# Altium project OrangePi_dev.PrjPcb
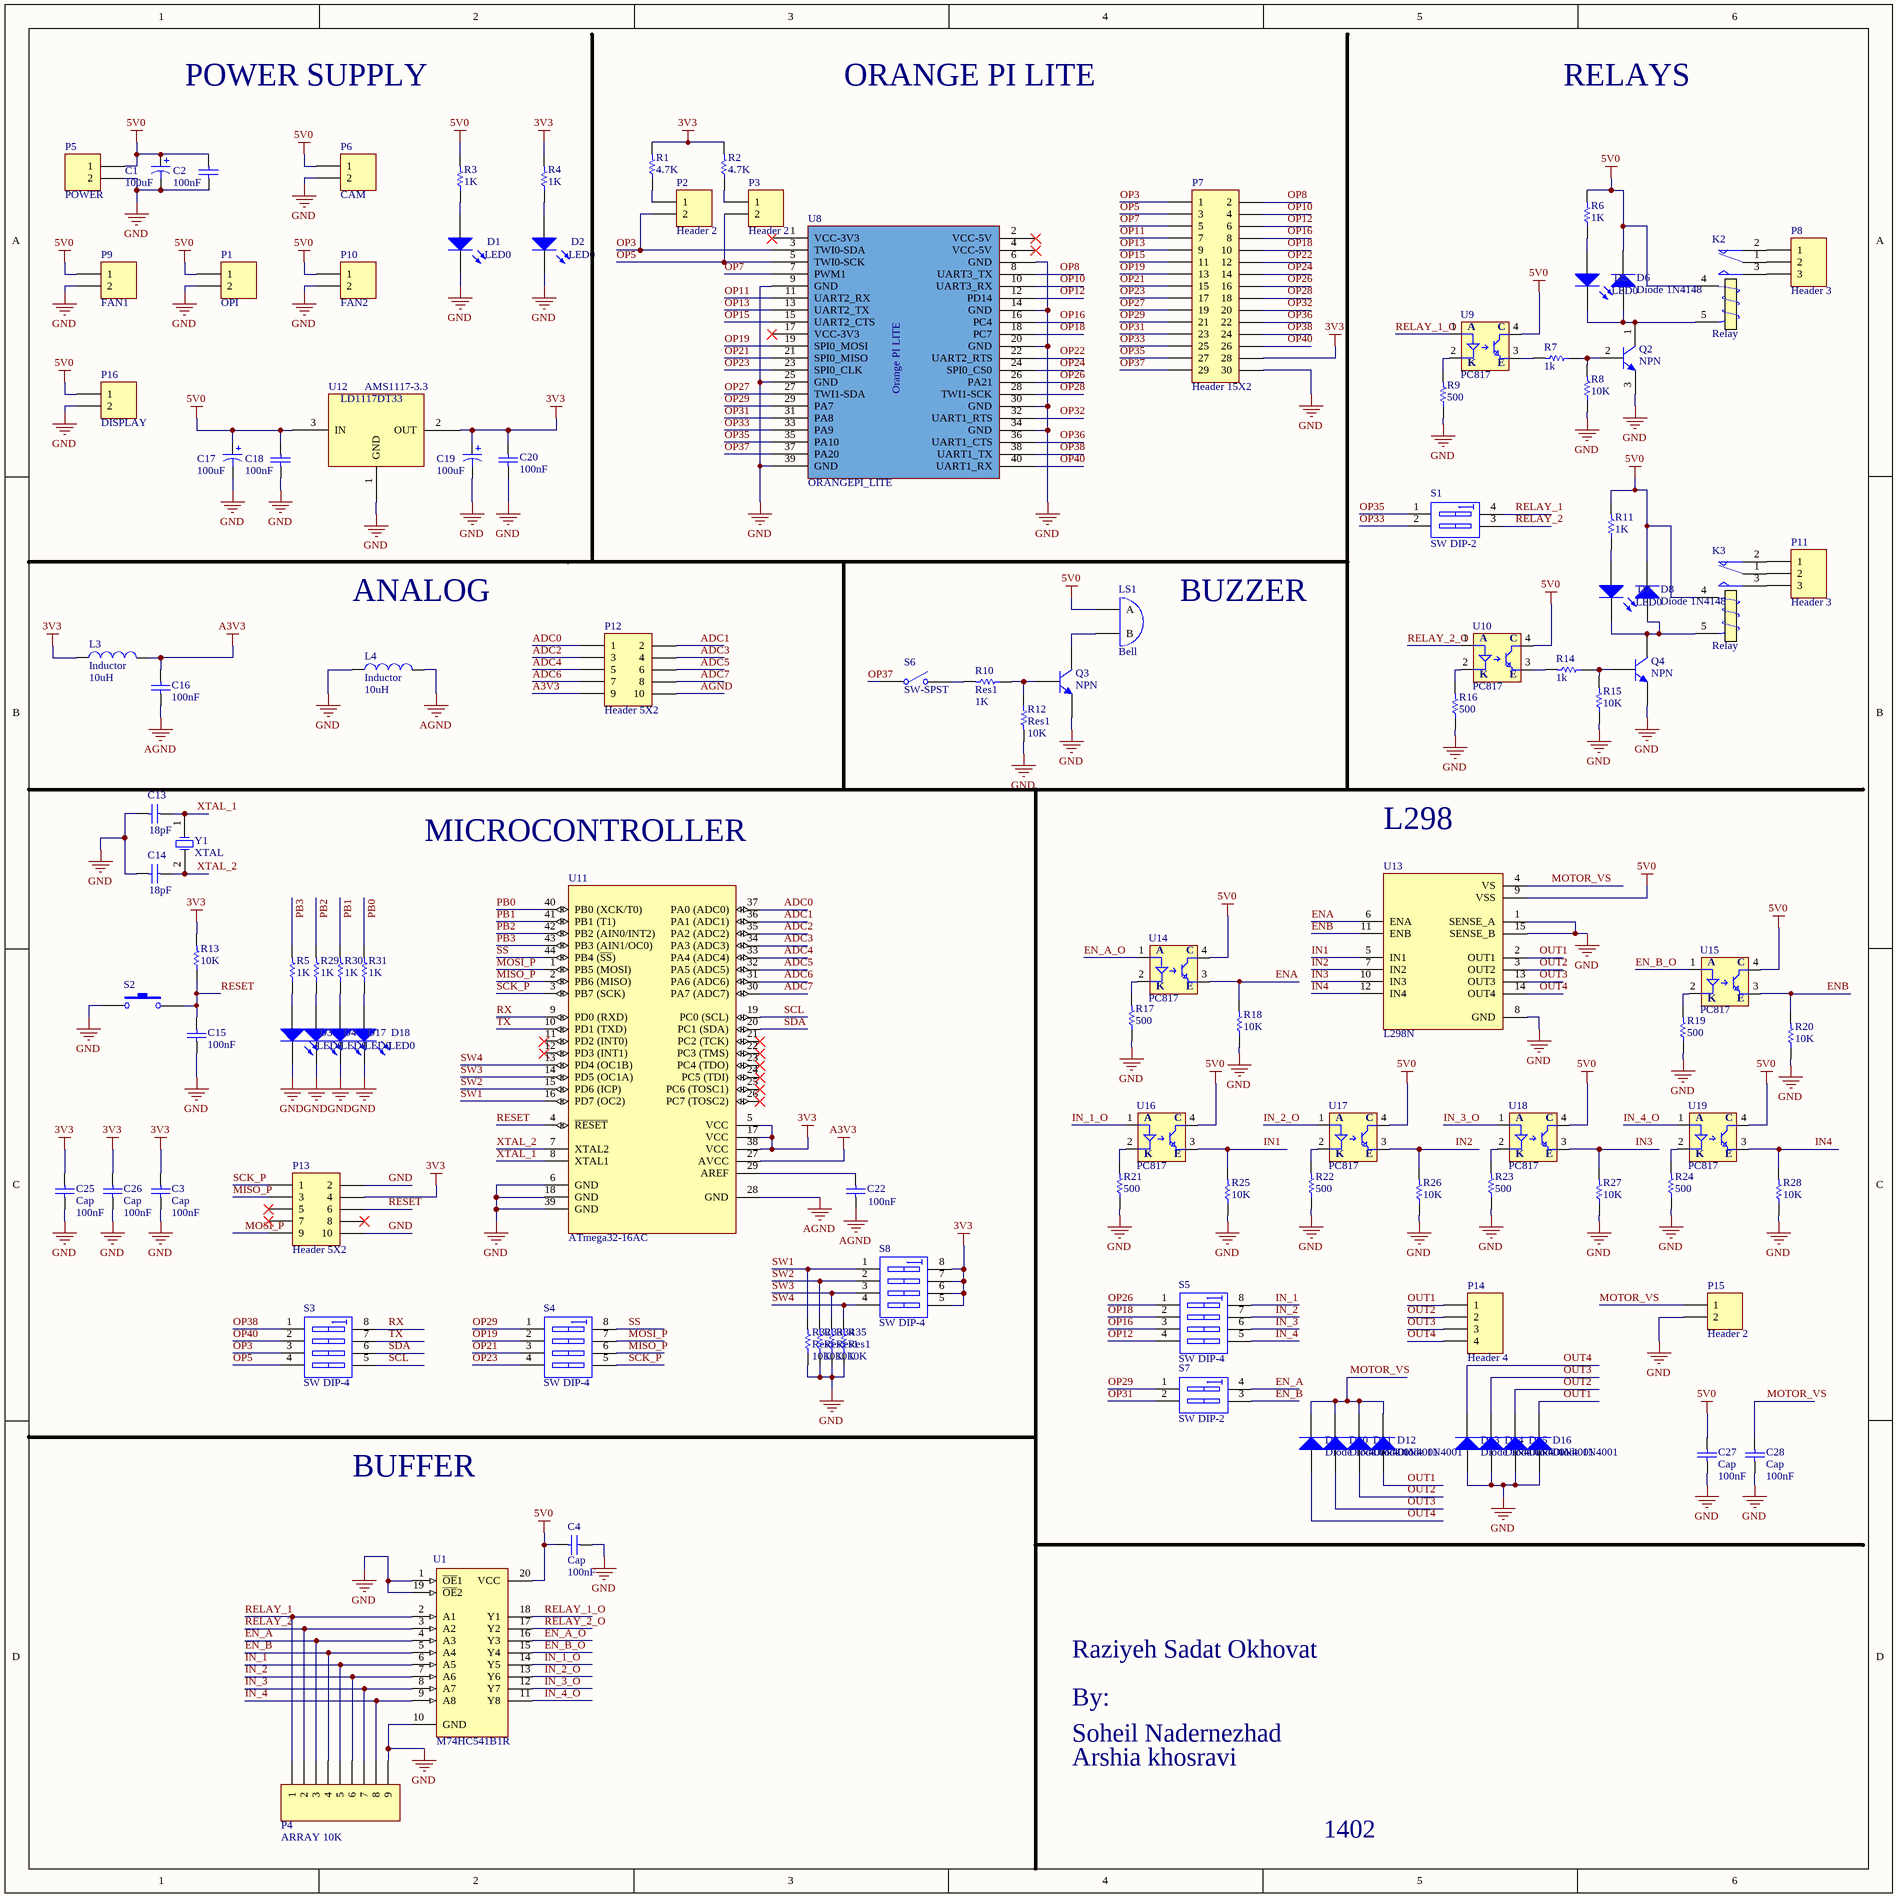
[diagram p0: OrangePi_dev4.SchDoc]
1 sheet, 116 parts. Net scope: global (net labels, ports and power ports of the same name join across sheets).
Board files: OrangePi_dev.PcbDoc, OrangePi_dev_backup.PcbDoc, OrangePi_dev3.PcbDoc

## Sheet OrangePi_dev4.SchDoc
size 400 x 400 mm; SheetNumber: 1; SheetTotal: 1

### Parts
C1  100uF  [CAP_AL]
C2  100nF  [CAP_1206]
C3  Cap  value 100nF  [CAP_1206]
C4  Cap  value 100nF  [CAP_1206]
C13  18pF  [CAP_1206]
C14  18pF  [CAP_1206]
C15  100nF  [CAP_1206]
C16  100nF  [CAP_1206]
C17  100uF  [CAP_AL]
C18  100nF  [CAP_1206]
C19  100uF  [CAP_AL]
C20  100nF  [CAP_1206]
C22  value 100nF  [CAP_1206]  (hidden comment: Cap)
C25  Cap  value 100nF  [CAP_1206]
C26  Cap  value 100nF  [CAP_1206]
C27  Cap  value 100nF  [CAP_1206]
C28  Cap  value 100nF  [CAP_1206]
D1  LED0  [LED_1206]
D2  LED0  [LED_1206]
D3  LED0  [LED_1206]
D4  LED0  [LED_1206]
D5  LED0  [LED_1206]
D6  Diode 1N4148  [1N4148]
D7  LED0  [LED_1206]
D8  Diode 1N4148  [1N4148]
D9  Diode 1N4001  [1N4007]
D10  Diode 1N4001  [1N4007]
D11  Diode 1N4001  [1N4007]
D12  Diode 1N4001  [1N4007]
D13  Diode 1N4001  [1N4007]
D14  Diode 1N4001  [1N4007]
D15  Diode 1N4001  [1N4007]
D16  Diode 1N4001  [1N4007]
D17  LED0  [LED_1206]
D18  LED0  [LED_1206]
K2  Relay  [Relay bache milon]
K3  Relay  [Relay bache milon]
L3  Inductor  value 10uH  [INDUCTOR_1206]
L4  Inductor  value 10uH  [INDUCTOR_1206]
LS1  Bell  [BUZZER]
P1  OPI  [HDR1X2]
P2  Header 2  [HDR1X2]
P3  Header 2  [HDR1X2]
P4  ARRAY 10K  [RES_ARRAY]
P5  POWER  [TERMINAL2]
P6  CAM  [HDR1X2]
P7  Header 15X2  [HEADER2X15_RA]
P8  Header 3  [PHOENIX3]
P9  FAN1  [HDR1X2]
P10  FAN2  [HDR1X2]
P11  Header 3  [PHOENIX3]
P12  Header 5X2  [HEADER2x5_RA]
P13  Header 5X2  [BOX2x5]
P14  Header 4  [PHOENIX4]
P15  Header 2  [PHOENIX2]
P16  DISPLAY  [HDR1X2]
Q2  NPN  [C945]
Q3  NPN  [C945]
Q4  NPN  [C945]
R1  4.7k  [RES_1206]
R2  4.7k  [RES_1206]
R3  value 1K  [RES_1206]  (hidden comment: Res1)
R4  value 1K  [RES_1206]  (hidden comment: Res1)
R5  value 1K  [RES_1206]  (hidden comment: Res1)
R6  value 1K  [RES_1206]  (hidden comment: Res1)
R7  value 1k  [RES_1206]  (hidden comment: Res1)
R8  value 10K  [RES_1206]  (hidden comment: Res1)
R9  value 500  [RES_1206]  (hidden comment: Res1)
R10  Res1  value 1K  [RES_1206]
R11  value 1K  [RES_1206]  (hidden comment: Res1)
R12  Res1  value 10K  [RES_1206]
R13  10K  [RES_1206]
R14  value 1k  [RES_1206]  (hidden comment: Res1)
R15  value 10K  [RES_1206]  (hidden comment: Res1)
R16  value 500  [RES_1206]  (hidden comment: Res1)
R17  value 500  [RES_1206]  (hidden comment: Res1)
R18  value 10K  [RES_1206]  (hidden comment: Res1)
R19  value 500  [RES_1206]  (hidden comment: Res1)
R20  value 10K  [RES_1206]  (hidden comment: Res1)
R21  value 500  [RES_1206]  (hidden comment: Res1)
R22  value 500  [RES_1206]  (hidden comment: Res1)
R23  value 500  [RES_1206]  (hidden comment: Res1)
R24  value 500  [RES_1206]  (hidden comment: Res1)
R25  value 10K  [RES_1206]  (hidden comment: Res1)
R26  value 10K  [RES_1206]  (hidden comment: Res1)
R27  value 10K  [RES_1206]  (hidden comment: Res1)
R28  value 10K  [RES_1206]  (hidden comment: Res1)
R29  value 1K  [RES_1206]  (hidden comment: Res1)
R30  value 1K  [RES_1206]  (hidden comment: Res1)
R31  value 1K  [RES_1206]  (hidden comment: Res1)
R32  Res1  value 10K  [RES_1206]
R33  Res1  value 10K  [RES_1206]
R34  Res1  value 10K  [RES_1206]
R35  Res1  value 10K  [RES_1206]
S1  SW DIP-2  [SW_2]
S2  PB  [BUTTON]  (value not drawn)
S3  SW DIP-4  [SW_4]
S4  SW DIP-4  [SW_4]
S5  SW DIP-4  [SW_4]
S6  SW-SPST  [HDR1X2]
S7  SW DIP-2  [SW_2]
S8  SW DIP-4  [SW_4]
U1  M74HC541B1R  [74HC541]
U8  ORANGEPI_LITE  [OPI LITE]
U9  PC817  [PC817]
U10  PC817  [PC817]
U11  ATmega32-16AC  [Atmega32]
U12  AMS1117-3.3  [AMS1117]
U13  L298N  [L298N]
U14  PC817  [PC817]
U15  PC817  [PC817]
U16  PC817  [PC817]
U17  PC817  [PC817]
U18  PC817  [PC817]
U19  PC817  [PC817]
Y1  XTAL  [CRYSTAL]

### Nets
3V3: C3.1 C19.1 C20.2 C25.1 C26.1 L3.1 P7.28 P13.4 R1.2 R2.2 R4.2 R13.2 S8.5(B4) S8.6(B3) S8.7(B2) S8.8(B1) U11.5(VCC) U11.17(VCC) U11.38(VCC) U12.2(OUT)
5V0: C1.1 C2.2 C4.1 C17.1 C18.2 C27.1 D6.2(K) D8.2(K) K2.4(T1) K3.4(T1) LS1.1(A) P1.1 P5.1 P6.1 P9.1 P10.1 P16.1 R3.2 R6.2 R11.2 U1.20(VCC) U9.4(C) U10.4(C) U12.3(IN) U13.9(VSS) U14.4(C) U15.4(C) U16.4(C) U17.4(C) U18.4(C) U19.4(C)
A3V3: C16.2 L3.2 P12.9 U11.27(AVCC)
AGND: C16.1 C22.1 L4.2 P12.10 U11.28(GND)
GND: C1.2 C2.1 C3.2 C4.2 C13.1 C14.1 C15.1 C17.2 C18.1 C19.2 C20.1 C25.2 C26.2 C27.2 C28.2 D1.2(K) D2.2(K) D3.2(K) D4.2(K) D13.1(A) D14.1(A) D15.1(A) D16.1(A) D17.2(K) D18.2(K) L4.1 P1.2 P4.9 P5.2 P6.2 P7.30 P9.2 P10.2 P13.2 P13.10 P15.2 P16.2 Q2.3(E) Q3.3(E) Q4.3(E) R8.1 R9.1 R12.2 R15.1 R16.1 R17.1 R18.1 R19.1 R20.1 R21.1 R22.1 R23.1 R24.1 R25.1 R26.1 R27.1 R28.1 R32.1 R33.1 R34.1 R35.1 S2.1 U1.1(~{OE}1) U1.10(GND) U1.19(~{OE}2) U8.6(GND) U8.9(GND) U8.14(GND) U8.20(GND) U8.25(GND) U8.30(GND) U8.34(GND) U8.39(GND) U11.6(GND) U11.18(GND) U11.39(GND) U12.1(GND) U13.1(SENSE_A) U13.8(GND) U13.15(SENSE_B)
ADC0: P12.1 U11.37(PA0_(ADC0))
ADC1: P12.2 U11.36(PA1_(ADC1))
ADC2: P12.3 U11.35(PA2_(ADC2))
ADC3: P12.4 U11.34(PA3_(ADC3))
ADC4: P12.5 U11.33(PA4_(ADC4))
ADC5: P12.6 U11.32(PA5_(ADC5))
ADC6: P12.7 U11.31(PA6_(ADC6))
ADC7: P12.8 U11.30(PA7_(ADC7))
EN_A: P4.3 S7.4(B1) U1.4(A3)
EN_A_O: U1.16(Y3) U14.1(A)
EN_B: P4.4 S7.3(B2) U1.5(A4)
EN_B_O: U1.15(Y4) U15.1(A)
ENA: R18.2 U13.6(ENA) U14.3(E)
ENB: R20.2 U13.11(ENB) U15.3(E)
IN1: R25.2 U13.5(IN1) U16.3(E)
IN2: R26.2 U13.7(IN2) U17.3(E)
IN3: R27.2 U13.10(IN3) U18.3(E)
IN4: R28.2 U13.12(IN4) U19.3(E)
IN_1: P4.5 S5.8(B1) U1.6(A5)
IN_1_O: U1.14(Y5) U16.1(A)
IN_2: P4.6 S5.7(B2) U1.7(A6)
IN_2_O: U1.13(Y6) U17.1(A)
IN_3: P4.7 S5.6(B3) U1.8(A7)
IN_3_O: U1.12(Y7) U18.1(A)
IN_4: P4.8 S5.5(B4) U1.9(A8)
IN_4_O: U1.11(Y8) U19.1(A)
MISO_P: P13.3 S4.6(B3) U11.2(PB6_(MISO))
MOSI_P: P13.9 S4.7(B2) U11.1(PB5_(MOSI))
MOTOR_VS: C28.1 D9.2(K) D10.2(K) D11.2(K) D12.2(K) P15.1 U13.4(VS)
OP3: P2.2 P7.1 S3.3(A3) U8.3(TWI0-SDA)
OP5: P3.2 P7.3 S3.4(A4) U8.5(TWI0-SCK)
OP7: P7.5 U8.7(PWM1)
OP8: P7.2 U8.8(UART3_TX)
OP10: P7.4 U8.10(UART3_RX)
OP11: P7.7 U8.11(UART2_RX)
OP12: P7.6 S5.4(A4) U8.12(PD14)
OP13: P7.9 U8.13(UART2_TX)
OP15: P7.11 U8.15(UART2_CTS)
OP16: P7.8 S5.3(A3) U8.16(PC4)
OP18: P7.10 S5.2(A2) U8.18(PC7)
OP19: P7.13 S4.2(A2) U8.19(SPI0_MOSI)
OP21: P7.15 S4.3(A3) U8.21(SPI0_MISO)
OP22: P7.12 U8.22(UART2_RTS)
OP23: P7.17 S4.4(A4) U8.23(SPI0_CLK)
OP24: P7.14 U8.24(SPI0_CS0)
OP26: P7.16 S5.1(A1) U8.26(PA21)
OP27: P7.19 U8.27(TWI1-SDA)
OP28: P7.18 U8.28(TWI1-SCK)
OP29: P7.21 S4.1(A1) S7.1(A1) U8.29(PA7)
OP31: P7.23 S7.2(A2) U8.31(PA8)
OP32: P7.20 U8.32(UART1_RTS)
OP33: P7.25 S1.2(A2) U8.33(PA9)
OP35: P7.27 S1.1(A1) U8.35(PA10)
OP36: P7.22 U8.36(UART1_CTS)
OP37: P7.29 S6.1(COMMON) U8.37(PA20)
OP38: P7.24 S3.1(A1) U8.38(UART1_TX)
OP40: P7.26 S3.2(A2) U8.40(UART1_RX)
OUT1: D12.1(A) D16.2(K) P14.1 U13.2(OUT1)
OUT2: D11.1(A) D15.2(K) P14.2 U13.3(OUT2)
OUT3: D10.1(A) D14.2(K) P14.3 U13.13(OUT3)
OUT4: D9.1(A) D13.2(K) P14.4 U13.14(OUT4)
PB0: R31.2 U11.40(PB0_(XCK/T0))
PB1: R30.2 U11.41(PB1_(T1))
PB2: R29.2 U11.42(PB2_(AIN0/INT2))
PB3: R5.2 U11.43(PB3_(AIN1/OC0))
RELAY_1: P4.1 S1.4(B1) U1.2(A1)
RELAY_1_O: U1.18(Y1) U9.1(A)
RELAY_2: P4.2 S1.3(B2) U1.3(A2)
RELAY_2_O: U1.17(Y2) U10.1(A)
RESET: C15.2 P13.6 R13.1 S2.2 U11.4(~{RESET})
RX: S3.8(B1) U11.9(PD0_(RXD))
SCK_P: P13.1 S4.5(B4) U11.3(PB7_(SCK))
SCL: S3.5(B4) U11.19(PC0_(SCL))
SDA: S3.6(B3) U11.20(PC1_(SDA))
SS: S4.8(B1) U11.44(PB4_(~{SS}))
SW1: R32.2 S8.1(A1) U11.16(PD7_(OC2))
SW2: R33.2 S8.2(A2) U11.15(PD6_(ICP))
SW3: R34.2 S8.3(A3) U11.14(PD5_(OC1A))
SW4: R35.2 S8.4(A4) U11.13(PD4_(OC1B))
TX: S3.7(B2) U11.10(PD1_(TXD))
XTAL_1: C13.2 U11.8(XTAL1) Y1.1(OSC1)
XTAL_2: C14.2 U11.7(XTAL2) Y1.2(OSC2)
NetC22_2: C22.2 U11.29(AREF)
NetD1_1: D1.1(A) R3.1
NetD2_1: D2.1(A) R4.1
NetD3_1: D3.1(A) R5.1
NetD4_1: D4.1(A) R29.1
NetD5_1: D5.1(A) R6.1
NetD5_2: D5.2(K) D6.1(A) K2.5(T2) Q2.1(C)
NetD7_1: D7.1(A) R11.1
NetD7_2: D7.2(K) D8.1(A) K3.5(T2) Q4.1(C)
NetD17_1: D17.1(A) R30.1
NetD18_1: D18.1(A) R31.1
NetK2_1: K2.1(COM) P8.2
NetK2_2: K2.2(NC) P8.1
NetK2_3: K2.3(NO) P8.3
NetK3_1: K3.1(COM) P11.2
NetK3_2: K3.2(NC) P11.1
NetK3_3: K3.3(NO) P11.3
NetLS1_2: LS1.2(B) Q3.1(C)
NetP2_1: P2.1 R1.1
NetP3_1: P3.1 R2.1
NetQ2_2: Q2.2(B) R7.1 R8.2
NetQ3_2: Q3.2(B) R10.1 R12.1
NetQ4_2: Q4.2(B) R14.1 R15.2
NetR7_2: R7.2 U9.3(E)
NetR9_2: R9.2 U9.2(K)
NetR10_2: R10.2 S6.2(NO)
NetR14_2: R14.2 U10.3(E)
NetR16_2: R16.2 U10.2(K)
NetR17_2: R17.2 U14.2(K)
NetR19_2: R19.2 U15.2(K)
NetR21_2: R21.2 U16.2(K)
NetR22_2: R22.2 U17.2(K)
NetR23_2: R23.2 U18.2(K)
NetR24_2: R24.2 U19.2(K)

Not connected (* = marked no-connect by the designer): P13 5* 7* 8*; U8 1(VCC-3V3)* 2(VCC-5V)* 4(VCC-5V)* 17(VCC-3V3)*; U11 11(PD2_(INT0))* 12(PD3_(INT1))* 21(PC2_(TCK))* 22(PC3_(TMS))* 23(PC4_(TDO))* 24(PC5_(TDI))* 25(PC6_(TOSC1))* 26(PC7_(TOSC2))*

### Notes on the sheet
- POWER SUPPLY
- ORANGE PI LITE
- RELAYS
- ANALOG
- BUZZER
- L298
- MICROCONTROLLER
- BUFFER
- Raziyeh Sadat Okhovat
- By:
- Soheil Nadernezhad
- Arshia khosravi
- 1402
- (in symbol ORANGEPI_LITE) Orange PI LITE

### Library data of the parts
C1 C17 C19 = Cap Pol1: Polarized Capacitor (Radial); Published: 8-Jun-2000; LatestRevisionDate: 17-Jul-2002; LatestRevisionNote: Re-released for DXP Platform.; PackageReference: RB7.6-15; Publisher: Altium Limited; Value: 100uF
C2-C4 C13-C16 C18 C20 C22 C25-C28 = Cap: Capacitor; Published: 8-Jun-2000; LatestRevisionDate: 17-Jul-2002; LatestRevisionNote: Re-released for DXP Platform.; PackageReference: RAD-0.3; Publisher: Altium Limited
  C2 C15 C16 C18 C20: Value: 100nF
  C3 C4 C22 C25-C28: PackageDescription: Radial Cap, Thru-Hole; 2 Leads; 0.3 in Pin Spacing
  C13 C14: Value: 18pF
D1-D5 D7 D17 D18 = LED0: Typical INFRARED GaAs LED; Published: 8-Jun-2000; LatestRevisionDate: 08-Jul-2005; LatestRevisionNote: Mech Layer 1 removed.; PackageReference: LED-0; Publisher: Altium Limited; PackageDescription: LED; 2 Leads
D6 D8 = Diode 1N4148: High Conductance Fast Diode; Published: 8-Jun-2000; LatestRevisionDate: 17-Jul-2002; LatestRevisionNote: Re-released for DXP Platform.; DatasheetVersion: 1997; PackageReference: DO-35; Publisher: Altium Limited; PackageDescription: Diode, Axial; Body 3.8 x 1.9 mm (LxDia. max), Lead Dia. 0.53 mm (max); Code_JEDEC: DO-204-AH; ComponentLink1Description: Manufacturer Link; ComponentLink1URL: http://www.fairchildsemi.com/; ComponentLink2Description: Datasheet; ComponentLink2URL: http://www.fairchildsemi.com/ds/1N%2F1N4148.pdf
D9-D16 = Diode 1N4001: 1 Amp General Purpose Rectifier; Published: 8-Jun-2000; LatestRevisionDate: 17-Jul-2002; LatestRevisionNote: Re-released for DXP Platform.; DatasheetVersion: 1998; PackageVersion: Aug-1999; PackageReference: DO-41; Publisher: Altium Limited; PackageDescription: Diode, Axial; Body 5.2 x 2.7 mm (LxDia. max), Lead Dia. 0.86 mm (max); Code_JEDEC: DO-204-AL; ComponentLink1Description: Manufacturer Link; ComponentLink1URL: http://www.fairchildsemi.com/; ComponentLink2Description: Datasheet; ComponentLink2URL: http://www.fairchildsemi.com/ds/1N%2F1N4001.pdf
K2 K3 = Relay: SPDT Relay; Published: 8-Jun-2000; LatestRevisionDate: 17-Jul-2002; LatestRevisionNote: Re-released for DXP Platform.; PackageReference: MODULE5B; Publisher: Altium Limited
L3 L4 = Inductor: Code_IEC: 1005; Published: 8-Jun-2000; LatestRevisionDate: 29-May-2009; LatestRevisionNote: IPC-7351 Footprint Added.; PackageReference: 0402-A; Publisher: Altium Limited; PackageDescription: Chip Inductor; Code_JEITA: 0402
LS1 = Bell: Electrical Bell; Published: 24-Mar-1999; LatestRevisionDate: 17-Jul-2002; LatestRevisionNote: Re-released for DXP Platform.; PackageReference: PIN2; Publisher: Altium Limited
P1-P3 P5 P6 P9 P10 P15 P16 = Header 2: Header, 2-Pin; LatestRevisionDate: 17-Jul-2002; LatestRevisionNote: Re-released for DXP Platform.; Publisher: Altium Limited
P4 = Header 9: Header, 9-Pin; LatestRevisionDate: 17-Jul-2002; LatestRevisionNote: Re-released for DXP Platform.; Publisher: Altium Limited
P7 = Header 15X2: Header, 15-Pin, Dual row; LatestRevisionDate: 17-Jul-2002; LatestRevisionNote: Re-released for DXP Platform.; Publisher: Altium Limited
P8 P11 = Header 3: Header, 3-Pin; LatestRevisionDate: 17-Jul-2002; LatestRevisionNote: Re-released for DXP Platform.; Publisher: Altium Limited
P12 P13 = Header 5X2: Header, 5-Pin, Dual row; LatestRevisionDate: 17-Jul-2002; LatestRevisionNote: Re-released for DXP Platform.; Publisher: Altium Limited
P14 = Header 4: Header, 4-Pin; LatestRevisionDate: 17-Jul-2002; LatestRevisionNote: Re-released for DXP Platform.; Publisher: Altium Limited
Q2-Q4 = NPN: NPN Bipolar Transistor; Published: 8-Jun-2000; LatestRevisionDate: 17-Jul-2002; LatestRevisionNote: Re-released for DXP Platform.; PackageReference: TO-226-AA; Publisher: Altium Limited; PackageDescription: TO, Flat Index; 3 In-Line, Axial Leads; Body Dia. 4.8mm; Leads 0.55 x 0.51 mm (max); Code_JEDEC: TO-226-AA
R1-R35 = Res1: Resistor; Published: 8-Jun-2000; LatestRevisionDate: 17-Jul-2002; LatestRevisionNote: Re-released for DXP Platform.; PackageReference: AXIAL-0.3; Publisher: Altium Limited
  R1 R2: Value: 4.7K
  R10 R12 R32-R35: PackageDescription: Axial Device, Thru-Hole; 2 Leads; 0.3 in Pin Spacing
  R13: Value: 10K
S1 S7 = SW DIP-2: DIP Switch, 2 Position, SPST; Published: 24-Mar-1999; LatestRevisionDate: 17-Jul-2002; LatestRevisionNote: Re-released for DXP Platform.; PackageReference: DIP-4; Publisher: Altium Limited
S2 = SW-PB: Switch; Published: 24-Mar-1999; LatestRevisionDate: 17-Jul-2002; LatestRevisionNote: Re-released for DXP Platform.; PackageReference: SPST-2; Publisher: Altium Limited
S3-S5 S8 = SW DIP-4: DIP Switch, 4 Position, SPST; Published: 24-Mar-1999; LatestRevisionDate: 29-May-2009; LatestRevisionNote: IPC-7351 Footprint Added.; PackageVersion: Dec-2002; PackageReference: SO8; Publisher: Altium Limited; PackageDescription: 8-Pin Small Outline Integrated Circuit 1.27 mm Pitch; Code_JEDEC: MS-012-AA; Code_IPC: SOIC127P600-8
S6 = SW-SPST: Single-Pole, Single-Throw Switch; Published: 24-Mar-1999; LatestRevisionDate: 17-Jul-2002; LatestRevisionNote: Re-released for DXP Platform.; PackageReference: SPST-2; Publisher: Altium Limited; PackageDescription: Switch; 2 Leads
U1 = M74HC541B1R: Octal Bus Buffer with 3 State Outputs (Non Inverted); Published: 8-Jun-2000; LatestRevisionDate: 06-Jun-2005; LatestRevisionNote: Stylized 3D Model Added.; DatasheetVersion: Oct-1993; PackageVersion: Jun-1998; PackageReference: DIP20; Publisher: Altium Limited; PackageDescription: DIP; 20 Leads; Row Spacing 7.62 mm; Pitch 2.54 mm; Code_JEDEC: MS-015-AE; ComponentLink1Description: Manufacturer Link; ComponentLink1URL: http://www.st.com/
U11 = ATmega32-16AC: 8-Bit AVR Microcontroller with 32K Bytes of In-System Programmable Flash Memory; Published: 17-Sep-2003; LatestRevisionDate: 16-Oct-2006; LatestRevisionNote: IPC-7351 Footprint Added.; DatasheetVersion: 2503C-AVR-10/02; PackageVersion: rev.B, Oct-2001; PackageReference: 44A; Publisher: Altium Limited; PackageDescription: 44-Pin Plastic Thin Profile Quad Flat Pack, 10 x 10 x 1.0 mm Body, 0.8 mm Pitch (TQFP); Supplier 1: Digi-Key; Supplier Part Number 1: ATMEGA32-16AC-ND; Supplier 2: Mouser; Supplier Part Number 2: 556-ATMEGA32-16AC; ComponentLink1Description: Datasheet; ComponentLink1URL: http://www.atmel.com/dyn/resources/prod_documents/doc2503.pdf; ComponentLink2Description: Atmel.com Home; ComponentLink2URL: http://www.atmel.com
U12 = LD1117DT33
Y1 = XTAL: Crystal Oscillator; Published: 8-Jun-2000; LatestRevisionDate: 17-Jul-2002; LatestRevisionNote: Re-released for DXP Platform.; PackageReference: R38; Publisher: Altium Limited; PackageDescription: Crystal, Thru-Hole; 2 Leads; Body 3.1 x 8.2 mm (Dia.xH)